# Altium schematic sheet 04 USB7002-PartB.SchDoc: USB7002 - Part B
size 420 x 297 mm; SheetNumber: 4; SheetTotal: 6
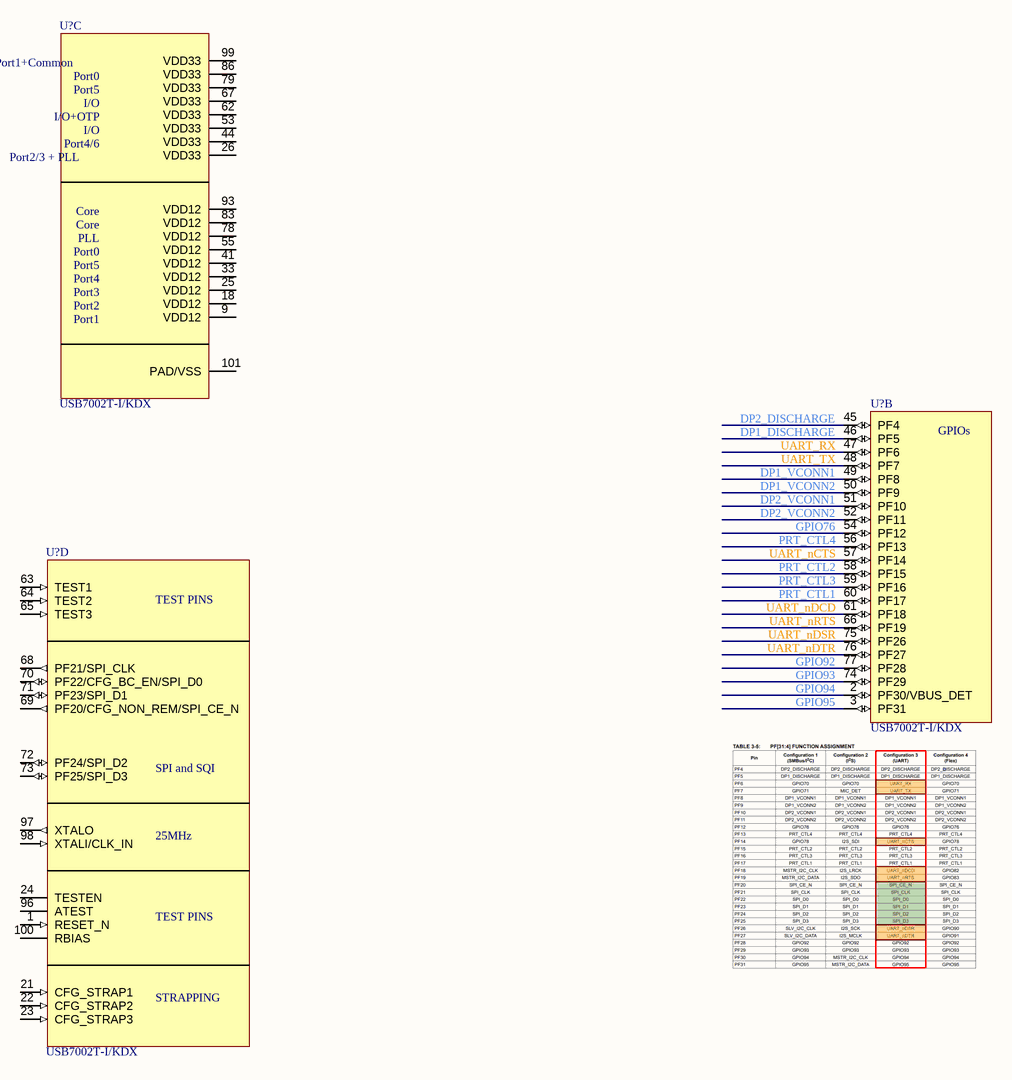
[diagram p0: 04 USB7002-PartB.SchDoc]

## Parts
(Parts that share a designator on the sheet are numbered #1, #2 ... from top to bottom, then left to right.)
U?#1  USB7002T-I/KDX  [QFN40P1200X1200X90_HS-101N]  (part C of 5)
U?#2  USB7002T-I/KDX  [QFN40P1200X1200X90_HS-101N]  (part B of 5)
U?#3  USB7002T-I/KDX  [QFN40P1200X1200X90_HS-101N]  (part D of 5)

## Nets

Not connected (* = marked no-connect by the designer): U?#1 9(VDD12) 18(VDD12) 25(VDD12) 26(VDD33) 33(VDD12) 41(VDD12) 44(VDD33) 53(VDD33) 55(VDD12) 62(VDD33) 67(VDD33) 78(VDD12) 79(VDD33) 83(VDD12) 86(VDD33) 93(VDD12) 99(VDD33) 101(PAD/VSS); U?#2 2(PF30/VBUS_DET) 3(PF31) 45(PF4) 46(PF5) 47(PF6) 48(PF7) 49(PF8) 50(PF9) 51(PF10) 52(PF11) 54(PF12) 56(PF13) 57(PF14) 58(PF15) 59(PF16) 60(PF17) 61(PF18) 66(PF19) 74(PF29) 75(PF26) 76(PF27) 77(PF28); U?#3 1(RESET_N) 21(CFG_STRAP1) 22(CFG_STRAP2) 23(CFG_STRAP3) 24(TESTEN) 63(TEST1) 64(TEST2) 65(TEST3) 68(PF21/SPI_CLK) 69(PF20/CFG_NON_REM/SPI_CE_N) 70(PF22/CFG_BC_EN/SPI_D0) 71(PF23/SPI_D1) 72(PF24/SPI_D2) 73(PF25/SPI_D3) 96(ATEST) 97(XTALO) 98(XTALI/CLK_IN) 100(RBIAS)

## Notes on the sheet
- (near U?#2) DP2_DISCHARGE
- (near U?#2) DP1_DISCHARGE
- (near U?#2) UART_RX
- (near U?#2) UART_TX
- (near U?#2) DP1_VCONN1
- (near U?#2) DP1_VCONN2
- (near U?#2) DP2_VCONN1
- (near U?#2) DP2_VCONN2
- (near U?#2) GPIO76
- (near U?#2) PRT_CTL4
- (near U?#2) UART_nCTS
- (near U?#2) PRT_CTL2
- (near U?#2) PRT_CTL3
- (near U?#2) PRT_CTL1
- (near U?#2) UART_nDCD
- (near U?#2) UART_nRTS
- (near U?#2) UART_nDSR
- (near U?#2) UART_nDTR
- (near U?#2) GPIO92
- (near U?#2) GPIO93
- (near U?#2) GPIO94
- (near U?#2) GPIO95
- Title
- Project
- Size
- Date
- Revision
- A3
- Designed By
- (in symbol USB7002T-I/KDX, part B) GPIOs
- (in symbol USB7002T-I/KDX, part C) Port1+Common; Port0; Port5; I/O; I/O+OTP; Port4/6; Port2/3 + PLL; Core; PLL; Port4; Port3; Port2; Port1
- (in symbol USB7002T-I/KDX, part D) TEST PINS; SPI and SQI; 25MHz; STRAPPING

## Library data of the parts
U?#1-U?#3 = USB7002T-I/KDX: USB Hub Controller USB 3.1 USB Interface 100-VQFN (12x12); manufacturer: Microchip Technology; mfr_part_number: USB7002T-I/KDX; assembler_number: USB7002T-I/KDX; datasheet: https://ww1.microchip.com/downloads/en/DeviceDoc/USB7002-Data-Sheet-DS00002670F.pdf